# EAGLE schematic haptic-glove-2 (EAGLE 9.6.2)
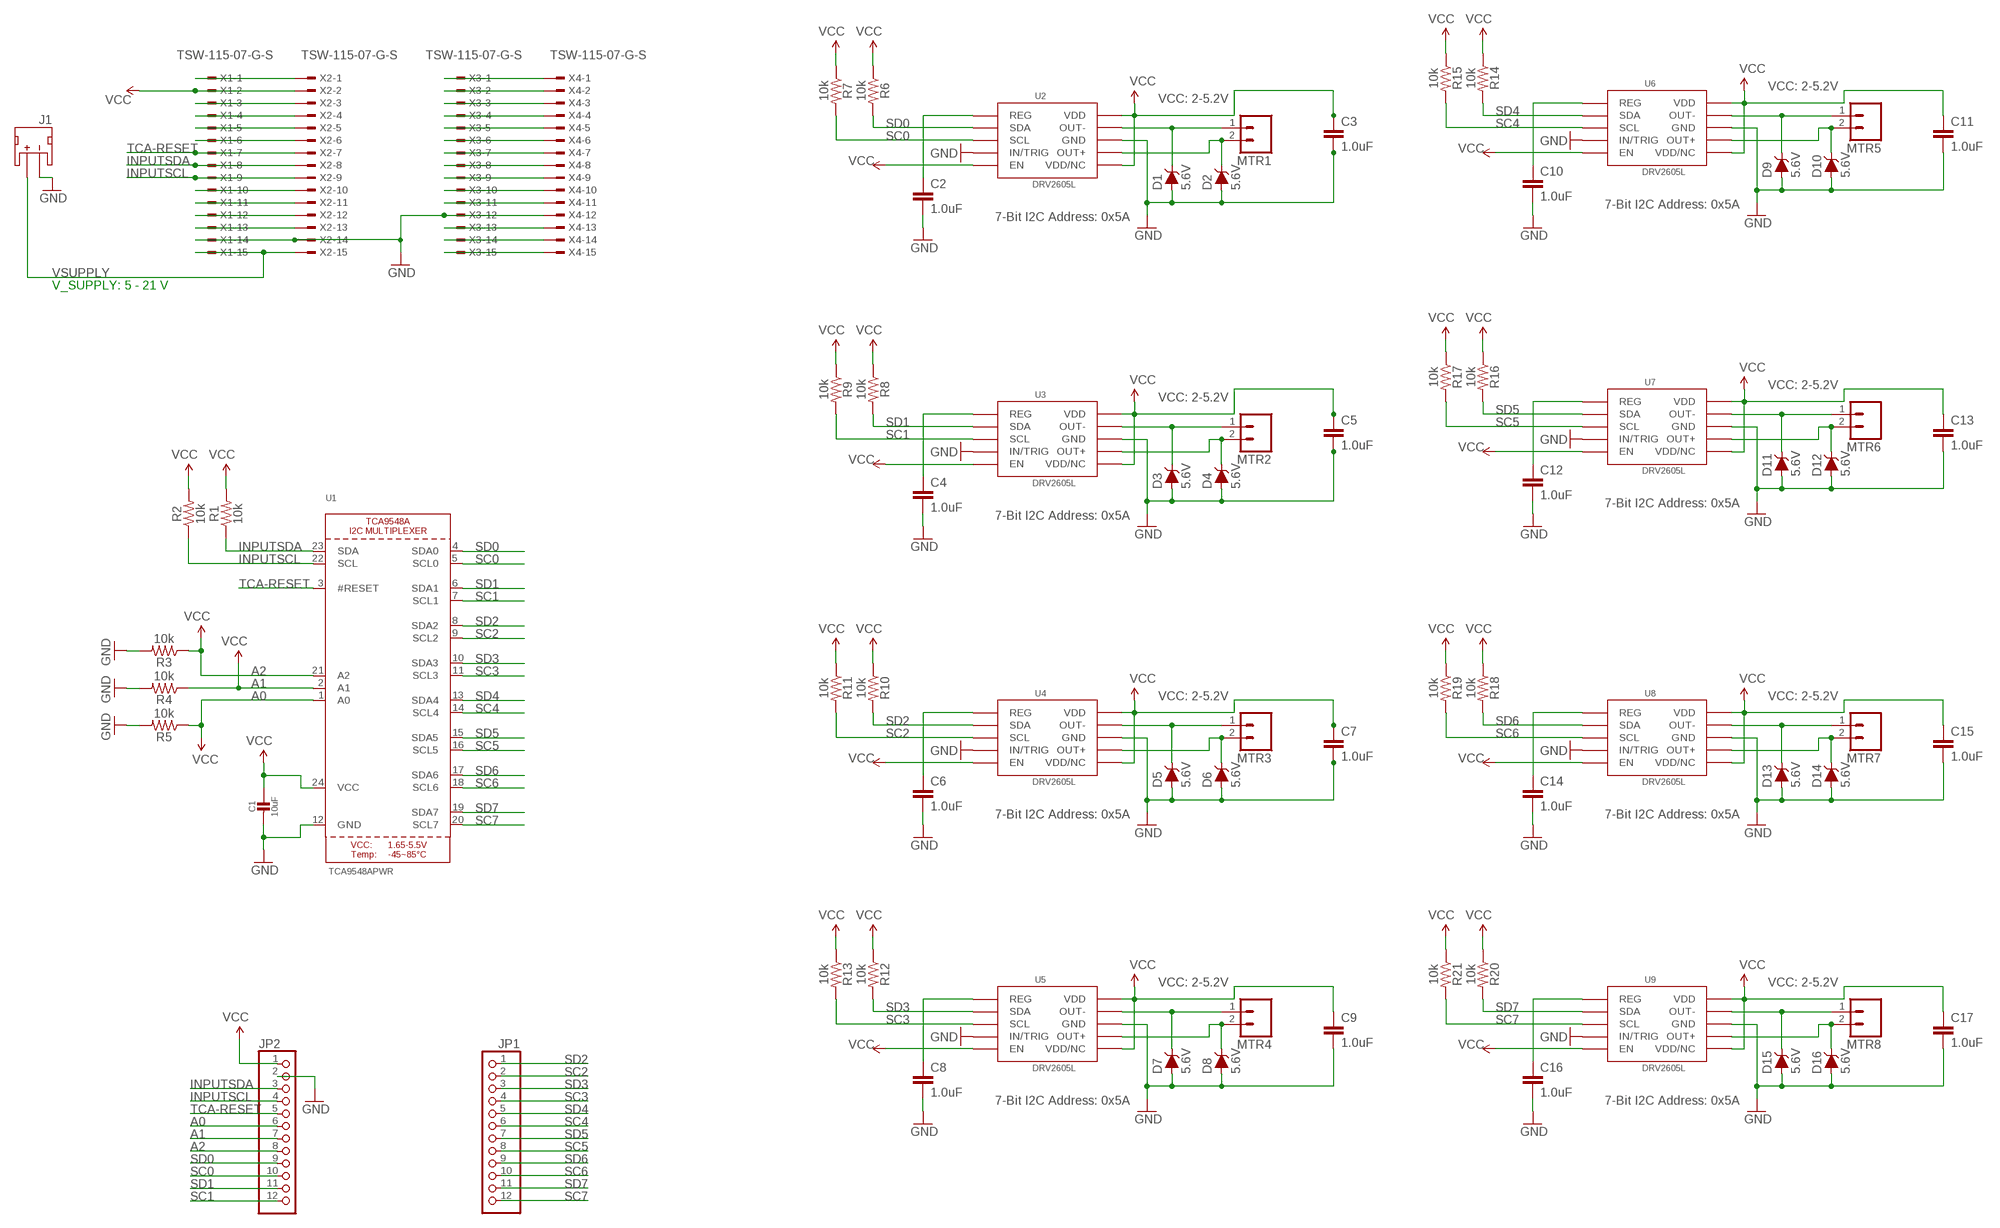
[diagram p0: schematic, sheet 1]

## Parts
C1  10uF  CAP_CERAMIC0805-NOOUTLINE  [0805-NO]
C2  1.0uF  1.0UF-16V-10%(0402)  [0402-CAP]
C3  1.0uF  1.0UF-16V-10%(0402)  [0402-CAP]
C4  1.0uF  1.0UF-16V-10%(0402)  [0402-CAP]
C5  1.0uF  1.0UF-16V-10%(0402)  [0402-CAP]
C6  1.0uF  1.0UF-16V-10%(0402)  [0402-CAP]
C7  1.0uF  1.0UF-16V-10%(0402)  [0402-CAP]
C8  1.0uF  1.0UF-16V-10%(0402)  [0402-CAP]
C9  1.0uF  1.0UF-16V-10%(0402)  [0402-CAP]
C10  1.0uF  1.0UF-16V-10%(0402)  [0402-CAP]
C11  1.0uF  1.0UF-16V-10%(0402)  [0402-CAP]
C12  1.0uF  1.0UF-16V-10%(0402)  [0402-CAP]
C13  1.0uF  1.0UF-16V-10%(0402)  [0402-CAP]
C14  1.0uF  1.0UF-16V-10%(0402)  [0402-CAP]
C15  1.0uF  1.0UF-16V-10%(0402)  [0402-CAP]
C16  1.0uF  1.0UF-16V-10%(0402)  [0402-CAP]
C17  1.0uF  1.0UF-16V-10%(0402)  [0402-CAP]
D1  5.6V  DIODE-ZENER-MMSZ5232BS  [SOD-323]
D2  5.6V  DIODE-ZENER-MMSZ5232BS  [SOD-323]
D3  5.6V  DIODE-ZENER-MMSZ5232BS  [SOD-323]
D4  5.6V  DIODE-ZENER-MMSZ5232BS  [SOD-323]
D5  5.6V  DIODE-ZENER-MMSZ5232BS  [SOD-323]
D6  5.6V  DIODE-ZENER-MMSZ5232BS  [SOD-323]
D7  5.6V  DIODE-ZENER-MMSZ5232BS  [SOD-323]
D8  5.6V  DIODE-ZENER-MMSZ5232BS  [SOD-323]
D9  5.6V  DIODE-ZENER-MMSZ5232BS  [SOD-323]
D10  5.6V  DIODE-ZENER-MMSZ5232BS  [SOD-323]
D11  5.6V  DIODE-ZENER-MMSZ5232BS  [SOD-323]
D12  5.6V  DIODE-ZENER-MMSZ5232BS  [SOD-323]
D13  5.6V  DIODE-ZENER-MMSZ5232BS  [SOD-323]
D14  5.6V  DIODE-ZENER-MMSZ5232BS  [SOD-323]
D15  5.6V  DIODE-ZENER-MMSZ5232BS  [SOD-323]
D16  5.6V  DIODE-ZENER-MMSZ5232BS  [SOD-323]
J1  JST_2MM_MALE  [JST-2-SMD]
JP1  HEADER-1X12  [1X12_ROUND]
JP2  HEADER-1X12  [1X12_ROUND]
MTR1  M02PTH  [1X02@1]
MTR2  M02PTH  [1X02@1]
MTR3  M02PTH  [1X02@1]
MTR4  M02PTH  [1X02@1]
MTR5  M02PTH  [1X02@1]
MTR6  M02PTH  [1X02@1]
MTR7  M02PTH  [1X02@1]
MTR8  M02PTH  [1X02@1]
R1  10k  10KOHM-0603-1/10W-1%  [0603]
R2  10k  10KOHM-0603-1/10W-1%  [0603]
R3  10k  10KOHM-0603-1/10W-1%  [0603]
R4  10k  10KOHM-0603-1/10W-1%  [0603]
R5  10k  10KOHM-0603-1/10W-1%  [0603]
R6  10k  10KOHM-0603-1/10W-1%  [0603]
R7  10k  10KOHM-0603-1/10W-1%  [0603]
R8  10k  10KOHM-0603-1/10W-1%  [0603]
R9  10k  10KOHM-0603-1/10W-1%  [0603]
R10  10k  10KOHM-0603-1/10W-1%  [0603]
R11  10k  10KOHM-0603-1/10W-1%  [0603]
R12  10k  10KOHM-0603-1/10W-1%  [0603]
R13  10k  10KOHM-0603-1/10W-1%  [0603]
R14  10k  10KOHM-0603-1/10W-1%  [0603]
R15  10k  10KOHM-0603-1/10W-1%  [0603]
R16  10k  10KOHM-0603-1/10W-1%  [0603]
R17  10k  10KOHM-0603-1/10W-1%  [0603]
R18  10k  10KOHM-0603-1/10W-1%  [0603]
R19  10k  10KOHM-0603-1/10W-1%  [0603]
R20  10k  10KOHM-0603-1/10W-1%  [0603]
R21  10k  10KOHM-0603-1/10W-1%  [0603]
U1  TCA9548APWR  TCA9548A  [TSSOP24]
U2  DRV2605L  [VSSOP-10]
U3  DRV2605L  [VSSOP-10]
U4  DRV2605L  [VSSOP-10]
U5  DRV2605L  [VSSOP-10]
U6  DRV2605L  [VSSOP-10]
U7  DRV2605L  [VSSOP-10]
U8  DRV2605L  [VSSOP-10]
U9  DRV2605L  [VSSOP-10]
X1  TSW-115-07-G-S  [TSW-115-XX-G-S]
X2  TSW-115-07-G-S  [TSW-115-XX-G-S]
X3  TSW-115-07-G-S  [TSW-115-XX-G-S]
X4  TSW-115-07-G-S  [TSW-115-XX-G-S]

## Nets
A0: JP2.6 R5.1 U1.1(A0) ; supply symbol labelled VCC
A1: JP2.7 R4.1 U1.2(A1) ; supply symbol labelled VCC
A2: JP2.8 R3.1 U1.21(A2) ; supply symbol labelled VCC
EN1: X3.2 X4.2
EN2: X3.4 X4.4
EN3: X3.8 X4.8
EN4: X3.11 X4.11
GND: C1.2 C2.2 C3.2 C4.2 C5.2 C6.2 C7.2 C8.2 C9.2 C10.2 C11.2 C12.2 C13.2 C14.2 C15.2 C16.2 C17.2 D1.A D2.A D3.A D4.A D5.A D6.A D7.A D8.A D9.A D10.A D11.A D12.A D13.A D14.A D15.A D16.A J1.1(-) JP2.2 R3.2 R4.2 R5.2 U1.12(GND) U2.P$4(IN/TRIG) U2.P$8(GND) U3.P$4(IN/TRIG) U3.P$8(GND) U4.P$4(IN/TRIG) U4.P$8(GND) U5.P$4(IN/TRIG) U5.P$8(GND) U6.P$4(IN/TRIG) U6.P$8(GND) U7.P$4(IN/TRIG) U7.P$8(GND) U8.P$4(IN/TRIG) U8.P$8(GND) U9.P$4(IN/TRIG) U9.P$8(GND) X1.14 X2.14 X3.12 X4.12
IN/TRIG1: X3.1 X4.1
IN/TRIG2: X3.3 X4.3
IN/TRIG3: X3.7 X4.7
IN/TRIG4: X3.10 X4.10
IN/TRIG5: X1.6 X2.6
INPUTSCL: JP2.4 R2.1 U1.22(SCL) X1.9 X2.9
INPUTSDA: JP2.3 R1.1 U1.23(SDA) X1.8 X2.8
N$1: C4.1 U3.P$1(REG)
N$2: C10.1 U6.P$1(REG)
N$3: D9.C MTR5.1 U6.P$9(OUT-)
N$4: D3.C MTR2.1 U3.P$9(OUT-)
N$5: D4.C MTR2.2 U3.P$7(OUT+)
N$6: C8.1 U5.P$1(REG)
N$7: D10.C MTR5.2 U6.P$7(OUT+)
N$8: X1.1 X2.1
N$9: D7.C MTR4.1 U5.P$9(OUT-)
N$10: D8.C MTR4.2 U5.P$7(OUT+)
N$11: C6.1 U4.P$1(REG)
N$13: X1.3 X2.3
N$14: D5.C MTR3.1 U4.P$9(OUT-)
N$15: D6.C MTR3.2 U4.P$7(OUT+)
N$16: C12.1 U7.P$1(REG)
N$17: X1.4 X2.4
N$18: D11.C MTR6.1 U7.P$9(OUT-)
N$19: D12.C MTR6.2 U7.P$7(OUT+)
N$20: C14.1 U8.P$1(REG)
N$21: X1.5 X2.5
N$22: D13.C MTR7.1 U8.P$9(OUT-)
N$23: D14.C MTR7.2 U8.P$7(OUT+)
N$24: C16.1 U9.P$1(REG)
N$25: D15.C MTR8.1 U9.P$9(OUT-)
N$26: D16.C MTR8.2 U9.P$7(OUT+)
N$28: C2.1 U2.P$1(REG)
N$29: X1.10 X2.10
N$30: X1.11 X2.11
N$31: D1.C MTR1.1 U2.P$9(OUT-)
N$32: D2.C MTR1.2 U2.P$7(OUT+)
N$34: X1.12 X2.12
N$35: X1.13 X2.13
N$46: X3.5 X4.5
N$47: X3.6 X4.6
N$50: X3.9 X4.9
N$55: X3.13 X4.13
N$58: X3.14 X4.14
N$59: X3.15 X4.15
SC0: JP2.10 R7.2 U1.5(SCL0) U2.P$2(SCL)
SC1: JP2.12 R9.2 U1.7(SCL1) U3.P$2(SCL)
SC2: JP1.2 R11.2 U1.9(SCL2) U4.P$2(SCL)
SC3: JP1.4 R13.2 U1.11(SCL3) U5.P$2(SCL)
SC4: JP1.6 R15.2 U1.14(SCL4) U6.P$2(SCL)
SC5: JP1.8 R17.2 U1.16(SCL5) U7.P$2(SCL)
SC6: JP1.10 R19.2 U1.18(SCL6) U8.P$2(SCL)
SC7: JP1.12 R21.2 U1.20(SCL7) U9.P$2(SCL)
SD0: JP2.9 R6.2 U1.4(SDA0) U2.P$3(SDA)
SD1: JP2.11 R8.2 U1.6(SDA1) U3.P$3(SDA)
SD2: JP1.1 R10.2 U1.8(SDA2) U4.P$3(SDA)
SD3: JP1.3 R12.2 U1.10(SDA3) U5.P$3(SDA)
SD4: JP1.5 R14.2 U1.13(SDA4) U6.P$3(SDA)
SD5: JP1.7 R16.2 U1.15(SDA5) U7.P$3(SDA)
SD6: JP1.9 R18.2 U1.17(SDA6) U8.P$3(SDA)
SD7: JP1.11 R20.2 U1.19(SDA7) U9.P$3(SDA)
TCA-RESET: JP2.5 U1.3(#RESET) X1.7 X2.7
VCC: C1.1 C3.1 C5.1 C7.1 C9.1 C11.1 C13.1 C15.1 C17.1 JP2.1 R1.2 R2.2 R6.1 R7.1 R8.1 R9.1 R10.1 R11.1 R12.1 R13.1 R14.1 R15.1 R16.1 R17.1 R18.1 R19.1 R20.1 R21.1 U1.24(VCC) U2.P$5(EN) U2.P$6(VDD/NC) U2.P$10(VDD) U3.P$5(EN) U3.P$6(VDD/NC) U3.P$10(VDD) U4.P$5(EN) U4.P$6(VDD/NC) U4.P$10(VDD) U5.P$5(EN) U5.P$6(VDD/NC) U5.P$10(VDD) U6.P$5(EN) U6.P$6(VDD/NC) U6.P$10(VDD) U7.P$5(EN) U7.P$6(VDD/NC) U7.P$10(VDD) U8.P$5(EN) U8.P$6(VDD/NC) U8.P$10(VDD) U9.P$5(EN) U9.P$6(VDD/NC) U9.P$10(VDD) X1.2 X2.2
VSUPPLY: J1.2(+) X1.15 X2.15
Unconnected: J1.NC1(PAD1) J1.NC2(PAD2)

## Notes on the sheet
- VCC: 2-5.2V
- VCC: 2-5.2V
- 7-Bit I2C Address: 0x5A
- 7-Bit I2C Address: 0x5A
- V_SUPPLY: 5 - 21 V
- VCC: 2-5.2V
- VCC: 2-5.2V
- 7-Bit I2C Address: 0x5A
- 7-Bit I2C Address: 0x5A
- VCC: 2-5.2V | VCC: 2-5.2V
- 7-Bit I2C Address: 0x5A | 7-Bit I2C Address: 0x5A
- VCC: 2-5.2V | VCC: 2-5.2V
- 7-Bit I2C Address: 0x5A | 7-Bit I2C Address: 0x5A

## Library data of the parts
C1 = microbuilder:CAP_CERAMIC: Ceramic Capacitors For new designs, use the packages preceded by an '_' character since they are more reliable: The following footprints should be used on most boards: _0402 - Standard footprint for regular board layouts _0603 - Standard footprint for regular board layouts _0805 - Standard footprint for regular board layouts _1206 - Standard footprint for regular board layouts For extremely tight-pitch boards where space is at a premium, the following 'micro-pitch' footprints can be used (smaller pads, no silkscreen outline, etc.): _0402MP - Micro-pitch footprint for very dense/compact boards _0603MP - Micro-pitch footprint for very dense/compact boards _0805MP - Micro-pitch footprint for very dense/compact boards _1206MP - Micro-pitch footprint for very dense/compact boards
C2-C17 = SparkFun-Capacitors:1.0UF-16V-10%(0402); MF: MURATA; MPN: GRM155R61E105KA12D; OC_NEWARK: 03AC2571; PROD_ID: CAP-12417
D1-D16 = SparkFun-DiscreteSemi:DIODE-ZENER: Zener Diode A Zener diode allows current to flow from its anode to its cathode like a normal semiconductor diode, but it also permits current to flow in the reverse direction when its "Zener voltage" is reached. - WIkipedia; PROD_ID: DIO-12442
J1 = SparkFun-Connectors:JST_2MM_MALE: JST 2MM MALE RA CONNECTOR Two pin, compact surface mount connector. Commonly used as a battery input connection point. We really like the solid locking feeling and high current rating on these small connectors. We use these all the time as battery connectors. Mates to single-cell LiPo batteries. Here is the connector we sell at SparkFun: JST Right Angle Connector - White <https://www.sparkfun.com/products/8612> (PRT-08612) Datasheet <http://www.sparkfun.com/datasheets/Prototyping/Connectors/JST-Horizontal.pdf> It was used on these SparkFun products: SparkFun MOSFET Power Controller <https://www.sparkfun.com/products/11214> (PRT-11214) SparkFun Battery Babysitter - LiPo Battery Manager <https://www.sparkfun.com/products/13777> (PRT-13777) And many, many others that required a lipo battery connection.; OC_NEWARK: unknown; PROD_ID: CONN-11443; SF_ID: PRT-08612
JP1 JP2 = microbuilder:HEADER-1X12
MTR1-MTR8 = SparkFun-Connectors:M02: Standard 2-pin 0.1" header. Use with - straight break away headers ( PRT-00116) - right angle break away headers (PRT-00553) - swiss pins (PRT-00743) - machine pins (PRT-00117) - female headers (PRT-00115) Molex polarized connector foot print use with: PRT-08233 with associated crimp pins and housings. 2.54_SCREWTERM for use with PRT-10571. 3.5mm Screw Terminal footprints for PRT-08084 5mm Screw Terminal footprints for use with PRT-08432; OC_NEWARK: unknown
R1-R21 = SparkFun-Resistors:10KOHM: 10kΩ resistor A resistor is a passive two-terminal electrical component that implements electrical resistance as a circuit element. Resistors act to reduce current flow, and, at the same time, act to lower voltage levels within circuits. - Wikipedia; OC_NEWARK: unknown; PROD_ID: RES-00824
U1 = microbuilder:TCA9548A: TCA9548A I2C Multiplexer
U2-U9 = SparkFun-PowerIC:DRV2605L; OC_NEWARK: unknown; PROD_ID: IC-13504
X1-X4 = con-samtec:TSW-115-*-G-S: THROUGH-HOLE .025" SQ POST HEADER Source: Samtec TSW.pdf; MF: Samtec Inc.; MPN: TSW-115-07-G-S

## Net classes
0 default: width 0.254 mm, drill 0.381 mm, clearance 0.178 mm